# EAGLE design AquModule (EAGLE 6.6.0)
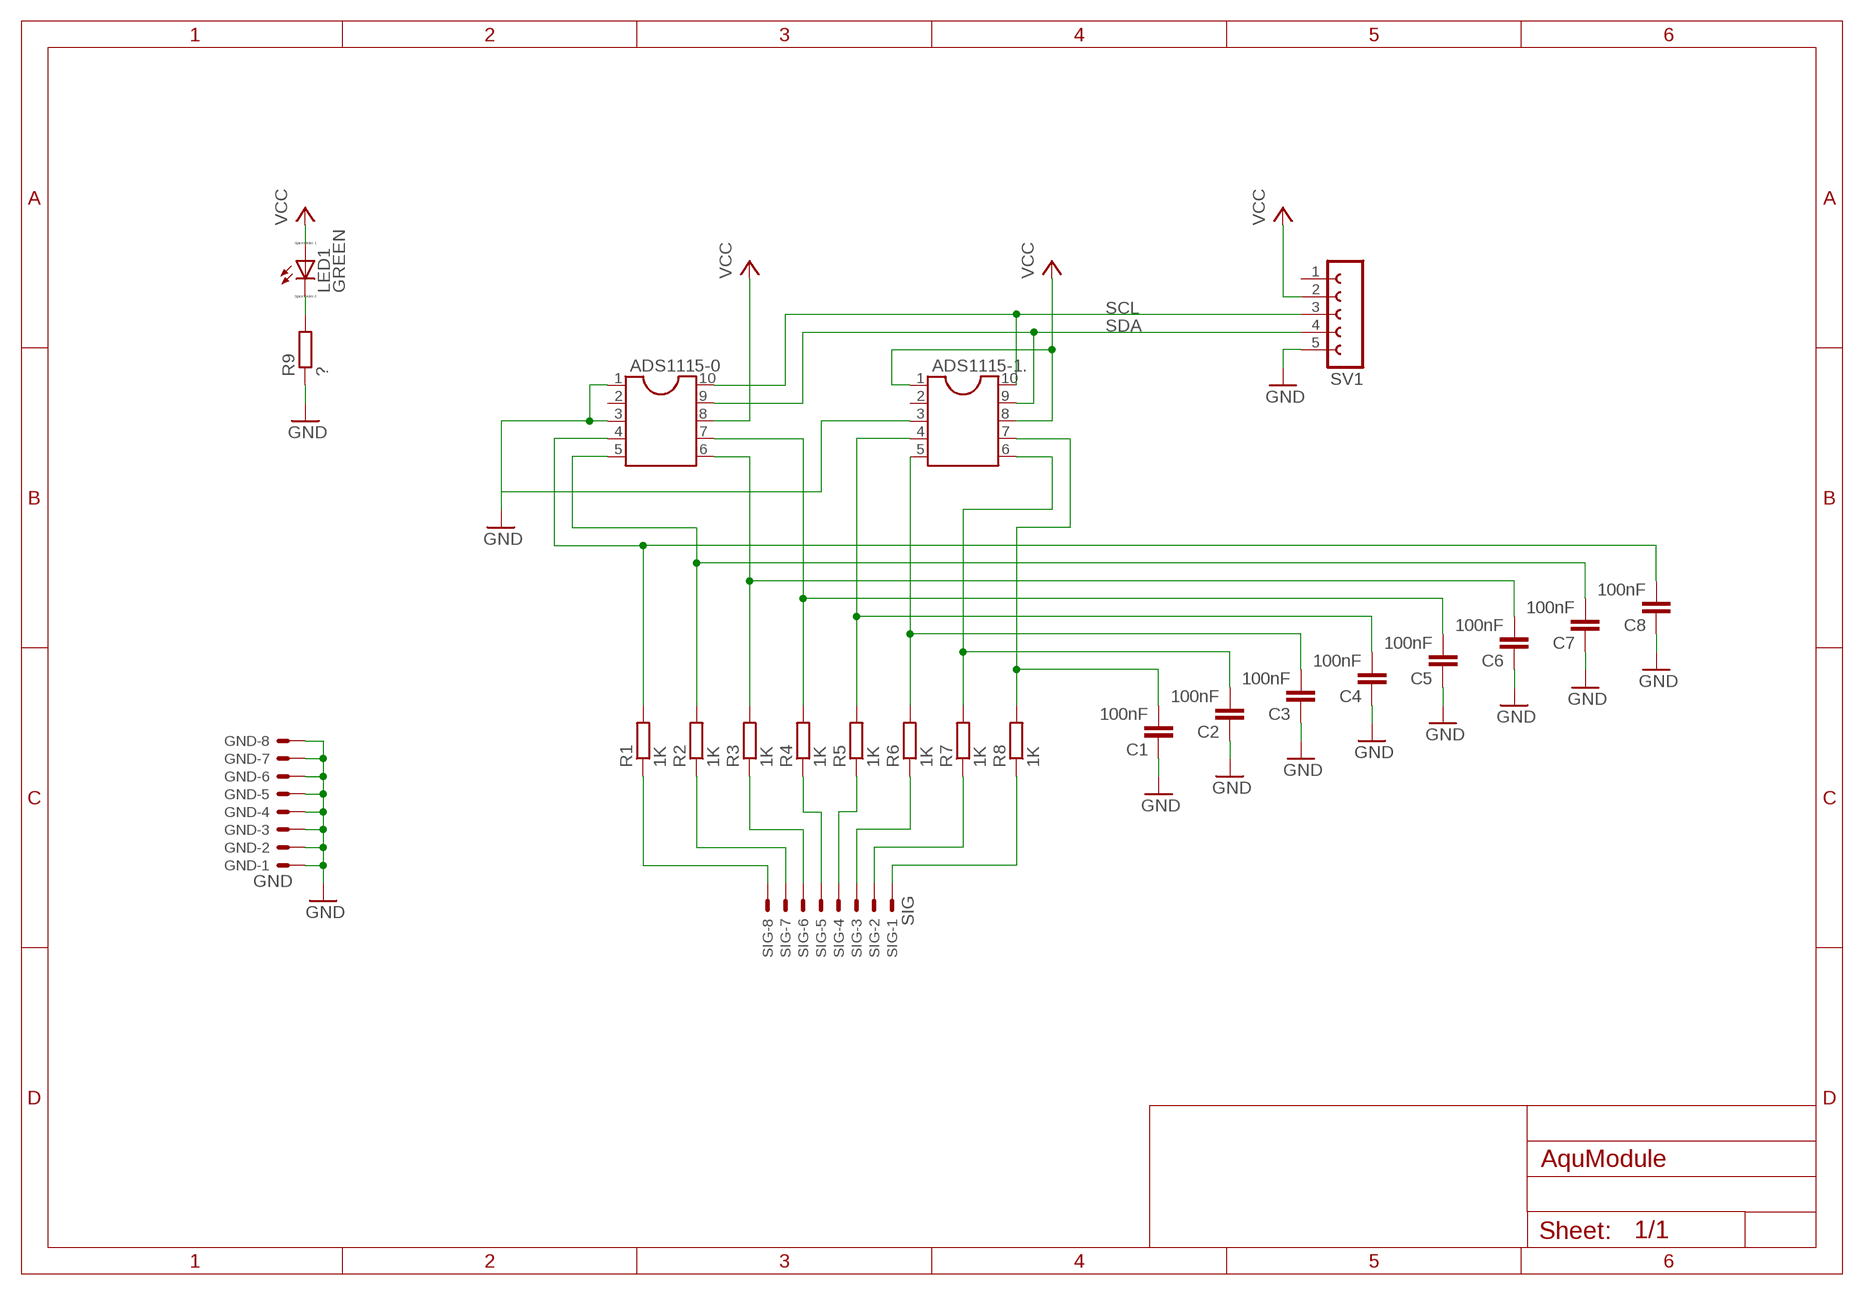
[diagram p0: schematic, sheet 1]

## Parts
ADS1115-0  DIL10  [DIL10]
ADS1115-1.  DIL10  [DIL10]
C1  100nF  C-EUC1005  [C1005]
C2  100nF  C-EUC1005  [C1005]
C3  100nF  C-EUC1005  [C1005]
C4  100nF  C-EUC1005  [C1005]
C5  100nF  C-EUC1005  [C1005]
C6  100nF  C-EUC1005  [C1005]
C7  100nF  C-EUC1005  [C1005]
C8  100nF  C-EUC1005  [C1005]
GND  GND  C-GRID-08-15-91  [15-91-08]
LED1  GREEN  LED_ELD260  [LED_LD260]
R1  1K  R-EU_R0603  [R0603]
R2  1K  R-EU_R0603  [R0603]
R3  1K  R-EU_R0603  [R0603]
R4  1K  R-EU_R0603  [R0603]
R5  1K  R-EU_R0603  [R0603]
R6  1K  R-EU_R0603  [R0603]
R7  1K  R-EU_R0603  [R0603]
R8  1K  R-EU_R0603  [R0603]
R9  ?  R-EU_0207/2V  [0207/2V]
SIG  SIG  C-GRID-08-15-91  [15-91-08]
SV1  FE05-1  [FE05-1]

## Nets
GND: ADS1115-0.1 ADS1115-0.3 ADS1115-1..3 C1.1 C2.1 C3.1 C4.1 C5.1 C6.1 C7.1 C8.1 GND.1 GND.2 GND.3 GND.4 GND.5 GND.6 GND.7 GND.8 R9.1 SV1.5
N$1: ADS1115-0.4 C8.2 R1.2
N$2: ADS1115-0.5 C7.2 R2.2
N$3: ADS1115-0.6 C6.2 R3.2
N$4: ADS1115-0.7 C5.2 R4.2
N$5: ADS1115-1..4 C4.2 R5.2
N$6: ADS1115-1..5 C3.2 R6.2
N$7: ADS1115-1..6 C2.2 R7.2
N$8: ADS1115-1..7 C1.2 R8.2
N$9: R1.1 SIG.8
N$10: R2.1 SIG.7
N$11: R3.1 SIG.6
N$12: R4.1 SIG.5
N$13: R5.1 SIG.4
N$14: R6.1 SIG.3
N$15: R7.1 SIG.2
N$16: R8.1 SIG.1
N$17: LED1.K(C) R9.2
SCL: ADS1115-0.10 ADS1115-1..10 SV1.3
SDA: ADS1115-0.9 ADS1115-1..9 SV1.4
VCC: ADS1115-0.8 ADS1115-1..1 ADS1115-1..8 LED1.A SV1.2
Unconnected: ADS1115-0.2 ADS1115-1..2 SV1.1

## Library data of the parts
ADS1115-0 ADS1115-1. = ic-package:DIL10: Dual In Line / Socket
C1-C8 = rcl:C-EU: CAPACITOR, European symbol
GND SIG = con-molex:C-GRID-08: CONNECTOR wire to board 2.54 mm (0.100") pitch header; OC_FARNELL: unknown; OC_NEWARK: unknown
LED1 = eagle-ltspice:LED_E: LED Source: http://www.osram.convergy.de Source: www.luxeon.com Source: www.kingbright.com; SPICEMODEL: NONE; SPICEPREFIX: D; SPICETYPE: diode
R1-R9 = resistor:R-EU_: RESISTOR, European symbol
SV1 = con-lsta:FE05-1: FEMALE HEADER; OC_FARNELL: unknown; OC_NEWARK: unknown

## Board
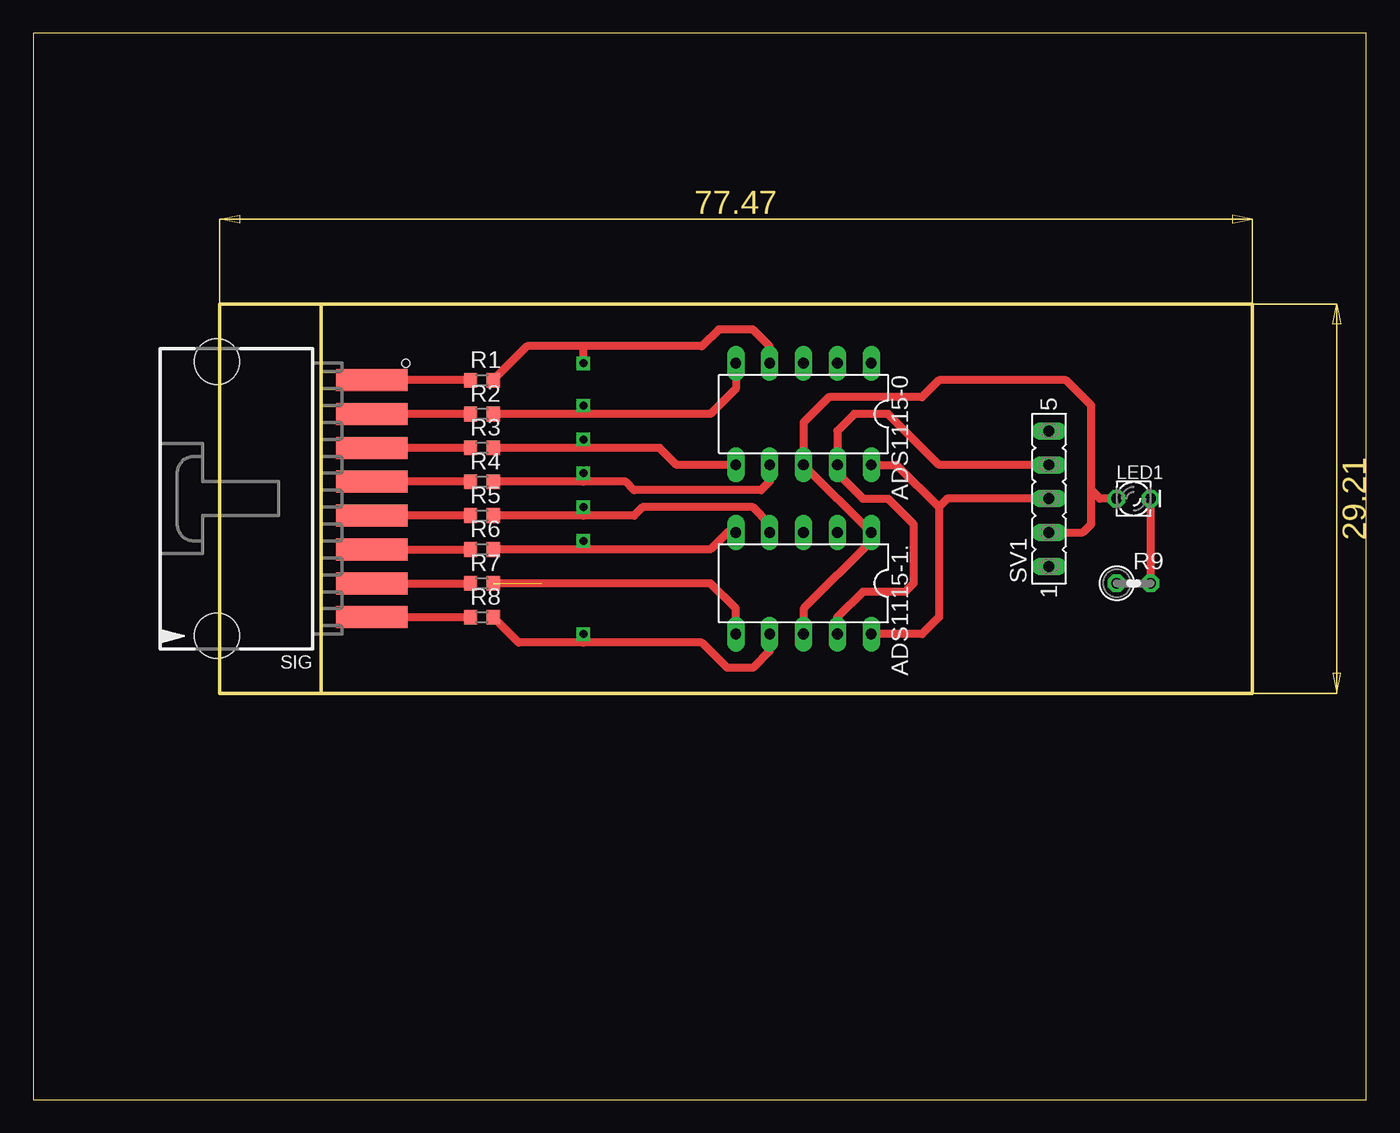
[diagram p1: board, top side]
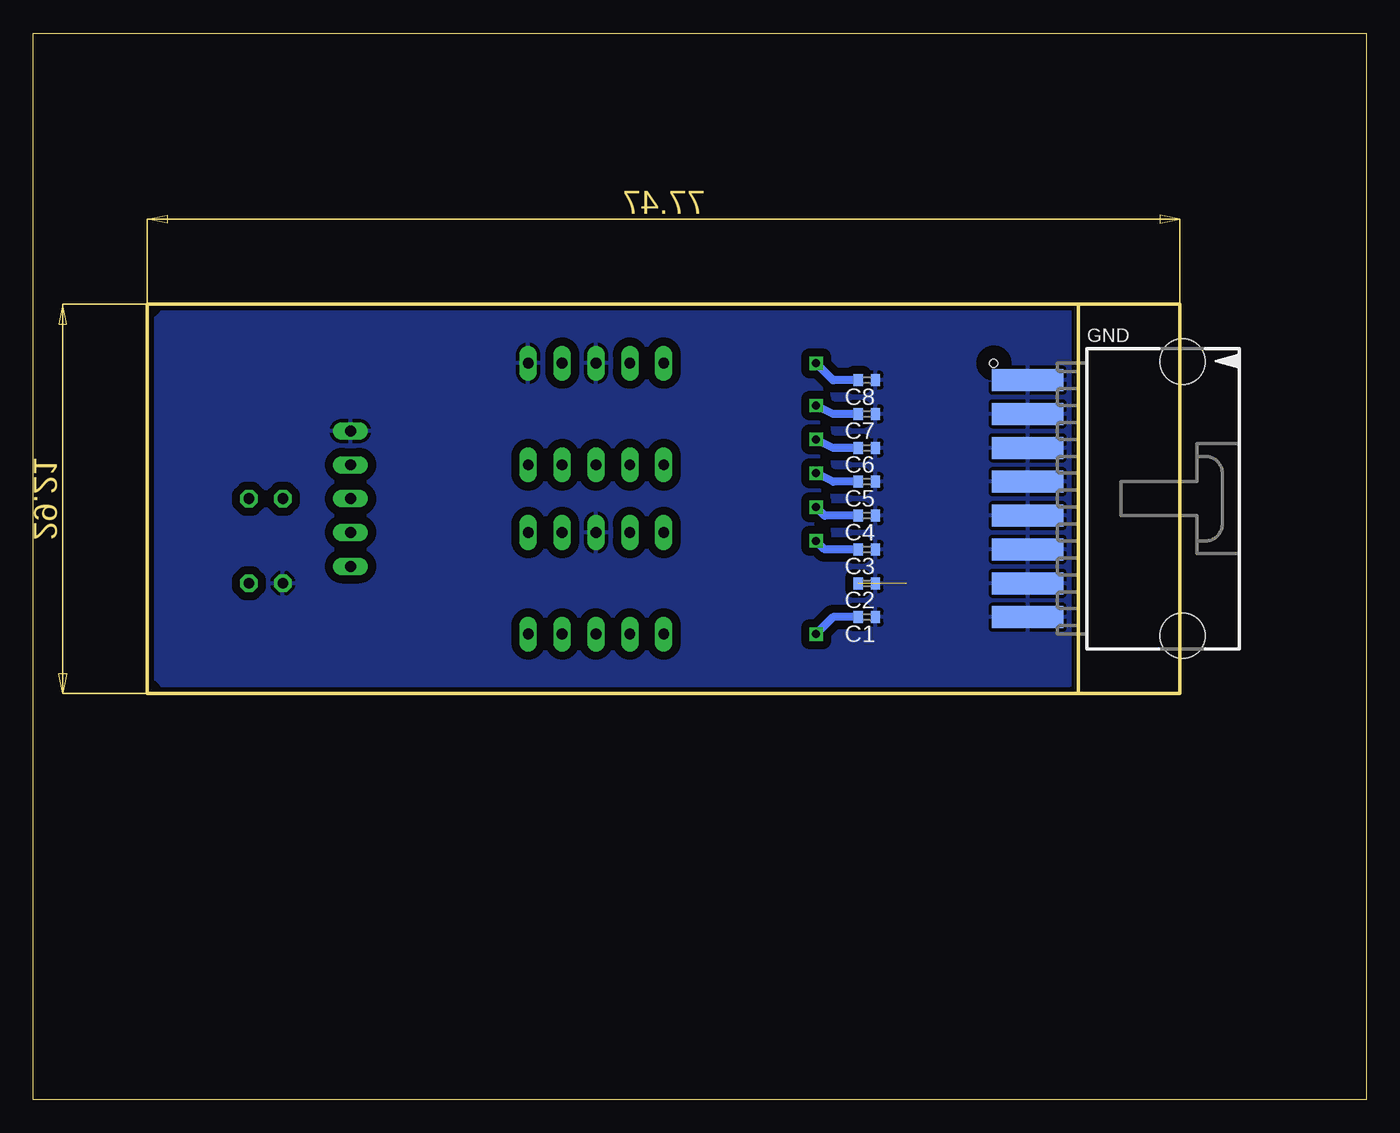
[diagram p2: board, bottom side, seen from below]

Size 100 x 80 mm. Coordinates in mm from the lower left corner, seen from the top.
Outline: 0,0 100,0 100,80 0,80 0,0
Copper layers (1*16): Top 0.035mm / dielectric 1.5mm / Bottom 0.035mm
Design rules "default": minimum track width 10mil, minimum drill 0.6mm, track to track 8mil, track to pad 8mil, pad to pad 8mil, via to via 8mil, smd to smd 8mil, copper to edge 40mil, drill to drill 8mil, minimum pad ring 10mil, minimum via ring 8mil, stop-mask expansion 4mil, vias tented up to drill 0mil, thermal gap 10mil
Holes 0.6 mm at 27.94,55.24
Milling: 7 lines

### Footprints (pad centres in the part's own frame; a part is rotated, then mirrored left to right if it is on the bottom)
DIL10 = drill 0.813 long: 1 -5.08,-3.81; 2 -2.54,-3.81; 3 0,-3.81; 4 2.54,-3.81; 5 5.08,-3.81; 6 5.08,3.81; 7 2.54,3.81; 8 0,3.81; 9 -2.54,3.81; 10 -5.08,3.81
C1005 = smd 0.7 x 0.9: 1 -0.65,0; 2 0.65,0
15-91-08 = smd 1.651 x 5.334: 1 -8.89,-10.795; 2 -6.35,-10.795; 3 -3.81,-10.795; 4 -1.27,-10.795; 5 1.27,-10.795; 6 3.81,-10.795; 7 6.35,-10.795; 8 8.89,-10.795 | hole 3.404: -10.287,0.838; 10.287,0.838
LED_LD260 = drill 0.813 octagon: A -1.27,0; K 1.27,0
R0603 = smd 1 x 1.1: 1 -0.85,0; 2 0.85,0
0207/2V = drill 0.813 octagon: 1 -1.27,0; 2 1.27,0
FE05-1 = drill 0.813 long: 1 -5.08,0; 2 -2.54,0; 3 0,0; 4 2.54,0; 5 5.08,0

### Placement (x,y rotation side)
ADS1115-0  57.78,51.44 180 top
ADS1115-1.  57.78,38.73 180 top
C1  37.47,36.2 180 bottom
C2  37.47,38.73 180 bottom
C3  37.47,41.27 180 bottom
C4  37.47,43.81 180 bottom
C5  37.47,46.35 180 bottom
C6  37.47,48.9 180 bottom
C7  37.47,51.44 180 bottom
C8  37.47,53.98 180 bottom
GND  14.61,45.09 270 bottom
LED1  82.55,45.09 0 top
R1  33.66,53.98 0 top
R2  33.66,51.44 0 top
R3  33.66,48.9 0 top
R4  33.66,46.35 0 top
R5  33.66,43.81 0 top
R6  33.66,41.27 0 top
R7  33.66,38.73 0 top
R8  33.66,36.2 0 top
R9  82.55,38.73 0 top
SIG  14.61,45.09 90 top
SV1  76.2,45.09 90 top

### Tracks (layer width: path | path; a pad name or v marks a point on that pad's centre or on a via)
GND
  pour Bottom (isolate 0.61, rank 3): 22.23,59.05 90.81,59.05 90.81,31.11 22.23,31.11
N$1  (via drill 0.6)
  Top 0.61: ADS1115-0.4 55.24,56.52 53.98,57.78 51.44,57.78 50.16,56.52 41.27,56.52 | 41.27,56.52 37.05,56.52 R1.2 | v41.27,55.24 41.27,56.52
  Bottom 0.61: C8.2 40.01,53.98 v41.27,55.24
N$2  (via drill 0.6)
  Top 0.61: ADS1115-0.5 52.7,53.34 50.8,51.44 41.27,51.44 | 41.27,51.44 R2.2 | v41.27,52.07 41.27,51.44
  Bottom 0.61: C7.2 40.01,51.44 v41.27,52.07
N$3  (via drill 0.6)
  Top 0.61: ADS1115-0.6 48.26,47.62 46.99,48.9 41.27,48.9 | 41.27,48.9 R3.2 | v41.27,49.53 41.27,48.9
  Bottom 0.61: C6.2 40.01,48.9 v41.27,49.53
N$4  (via drill 0.6)
  Top 0.61: ADS1115-0.7 55.24,46.35 54.61,45.72 45.09,45.72 44.45,46.35 41.27,46.35 | 41.27,46.35 R4.2 | v41.27,46.99 41.27,46.35
  Bottom 0.61: C5.2 40.01,46.35 v41.27,46.99
N$5  (via drill 0.6)
  Top 0.61: ADS1115-1..4 55.24,43.18 53.98,44.45 45.72,44.45 45.09,43.81 41.27,43.81 | 41.27,43.81 R5.2 | v41.27,44.45 41.27,43.81
  Bottom 0.61: C4.2 40.64,43.81 v41.27,44.45
N$6  (via drill 0.6)
  Top 0.61: ADS1115-1..5 52.07,42.55 50.8,41.27 41.27,41.27 | 41.27,41.27 R6.2 | v41.27,41.91 41.27,41.27
  Bottom 0.61: C3.2 40.64,41.27 v41.27,41.91
N$7  (1 unrouted)
  Top 0.61: ADS1115-1..6 52.7,36.83 50.8,38.73 R7.2
N$8  (via drill 0.6)
  Top 0.61: ADS1115-1..7 55.24,33.66 53.98,32.38 52.07,32.38 50.16,34.29 41.27,34.29 | 41.27,34.29 36.41,34.29 R8.2 | v41.27,34.92 41.27,34.29
  Bottom 0.61: 38.1,36.2 C1.2 40.01,36.2 v41.27,34.92
N$9
  Top 0.61: R1.1 SIG.8
N$10
  Top 0.61: R2.1 SIG.7
N$11
  Top 0.61: R3.1 SIG.6
N$12
  Top 0.61: R4.1 SIG.5
N$13
  Top 0.61: R5.1 SIG.4
N$14
  Top 0.61: SIG.3 R6.1
N$15
  Top 0.61: SIG.2 R7.1
N$16
  Top 0.61: SIG.1 R8.1
N$17
  Top 0.61: LED1.K R9.2
SCL
  Top 0.61: ADS1115-0.10 64.77,47.62 67.94,44.45 | 67.94,44.45 67.94,36.2 66.67,34.92 ADS1115-1..10 | SV1.3 68.58,45.09 67.94,44.45
SDA
  Top 0.61: ADS1115-1..9 60.33,36.2 62.23,38.1 65.41,38.1 66.04,38.73 66.04,43.18 64.14,45.09 62.23,45.09 60.33,46.99 ADS1115-0.9 60.33,50.16 61.59,51.44 64.14,51.44 67.94,47.62 SV1.4
VCC
  Top 0.61: ADS1115-1..8 57.78,36.83 62.87,41.91 ADS1115-1..1 ADS1115-0.8 57.78,50.8 59.69,52.7 66.67,52.7 67.94,53.98 77.47,53.98 79.38,52.07 79.38,45.72 | SV1.2 78.74,42.55 79.38,43.18 79.38,45.72 | LED1.A 80.01,45.09 79.38,45.72